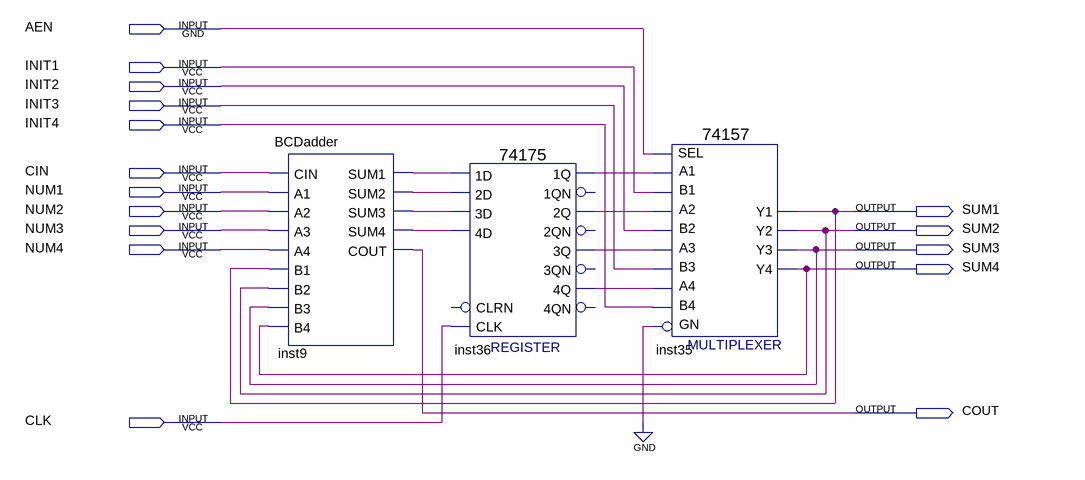
[diagram p0: schematic sheet]
// Quartus schematic BCDaccumulator.bdf as structural Verilog: 3 symbols, 16 pins
module BCDaccumulator (
  input  AEN,
  input  INIT1,
  input  INIT2,
  input  INIT3,
  input  INIT4,
  input  CIN,
  input  NUM1,
  input  NUM2,
  input  NUM3,
  input  NUM4,
  input  CLK,
  output SUM1,
  output SUM2,
  output SUM3,
  output SUM4,
  output COUT
);

  wire inst9_sum1, inst9_sum2, inst9_sum3, inst9_sum4, inst36_1q, inst36_2q, inst36_3q, inst36_4q;

  BCDadder inst9 (
    .CIN(CIN), .A1(NUM1), .A2(NUM2), .A3(NUM3), .A4(NUM4), .B1(SUM1), .B2(SUM2), .B3(SUM3), .B4(SUM4),
    .SUM1(inst9_sum1), .SUM2(inst9_sum2), .SUM3(inst9_sum3), .SUM4(inst9_sum4), .COUT(COUT));
  \74175  inst36 (
    .CLK(CLK), .\3D (inst9_sum3), .\2D (inst9_sum2), .\1D (inst9_sum1), .\4D (inst9_sum4), .\1Q (inst36_1q),
    .\3Q (inst36_3q), .\2Q (inst36_2q), .\4Q (inst36_4q));  // open: CLRN, 1QN, 2QN, 4QN, 3QN
  \74157  inst35 (
    .A1(inst36_1q), .B1(INIT1), .SEL(AEN), .B2(INIT2), .A3(inst36_3q), .B3(INIT3), .A2(inst36_2q),
    .B4(INIT4), .GN(1'b0), .A4(inst36_4q), .Y2(SUM2), .Y1(SUM1), .Y4(SUM4), .Y3(SUM3));
endmodule
